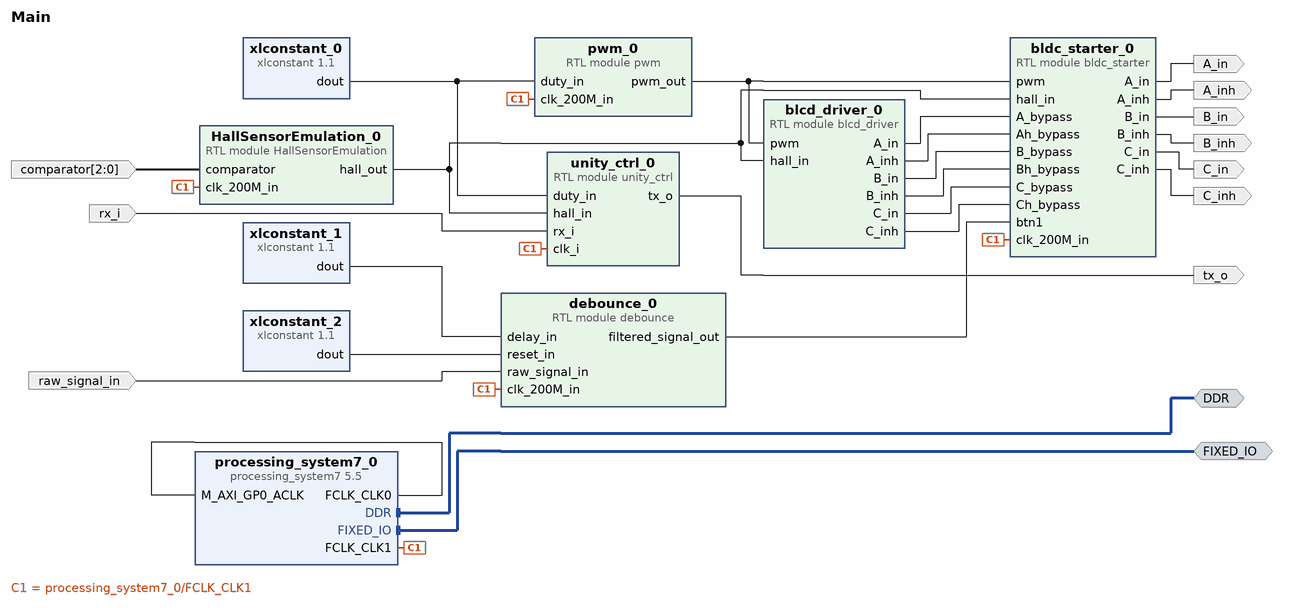
[diagram p0: block diagram of the top level]
# Vivado block design Main, xc7z010clg225-1, Vivado 2017.2
create_bd_design Main

create_bd_intf_port -mode Master -vlnv xilinx.com:interface:ddrx_rtl:1.0 DDR
create_bd_intf_port -mode Master -vlnv xilinx.com:display_processing_system7:fixedio_rtl:1.0 FIXED_IO
create_bd_port -dir I -from 2 -to 0 comparator
create_bd_port -dir O tx_o
create_bd_port -dir I rx_i
create_bd_port -dir O A_in
create_bd_port -dir O A_inh
create_bd_port -dir O B_in
create_bd_port -dir O B_inh
create_bd_port -dir O C_in
create_bd_port -dir O C_inh
create_bd_port -dir I raw_signal_in

create_bd_cell -type ip -vlnv xilinx.com:ip:xlconstant:1.1 xlconstant_0
set_property -dict {CONFIG.CONST_WIDTH 8 CONFIG.CONST_VAL 160} [get_bd_cells xlconstant_0]
create_bd_cell -type ip -vlnv xilinx.com:ip:processing_system7:5.5 processing_system7_0
set_property -dict [list \
  CONFIG.PCW_FCLK_CLK1_BUF TRUE \
  CONFIG.PCW_UIPARAM_DDR_FREQ_MHZ 533.333333 \
  CONFIG.PCW_APU_PERIPHERAL_FREQMHZ 666.666666 \
  CONFIG.PCW_SDIO_PERIPHERAL_FREQMHZ 100 \
  CONFIG.PCW_UART_PERIPHERAL_FREQMHZ 100 \
  CONFIG.PCW_I2C_PERIPHERAL_FREQMHZ 111.111115 \
  CONFIG.PCW_FPGA0_PERIPHERAL_FREQMHZ 50 \
  CONFIG.PCW_FPGA1_PERIPHERAL_FREQMHZ 200 \
  CONFIG.PCW_M_AXI_GP0_FREQMHZ 50 \
  CONFIG.PCW_USE_FABRIC_INTERRUPT 1 \
  CONFIG.PCW_NUM_F2P_INTR_INPUTS 1 \
  CONFIG.PCW_DQ_WIDTH 16 \
  CONFIG.PCW_DQS_WIDTH 2 \
  CONFIG.PCW_DM_WIDTH 2 \
  CONFIG.PCW_MIO_PRIMITIVE 32 \
  CONFIG.PCW_EN_CLK1_PORT 1 \
  CONFIG.PCW_IRQ_F2P_INTR 1 \
  CONFIG.PCW_PERIPHERAL_BOARD_PRESET part0 \
  CONFIG.PCW_PRESET_BANK1_VOLTAGE {LVCMOS 3.3V} \
  CONFIG.PCW_UIPARAM_DDR_MEMORY_TYPE {DDR 3 (Low Voltage)} \
  CONFIG.PCW_UIPARAM_DDR_BUS_WIDTH {16 Bit} \
  CONFIG.PCW_UIPARAM_DDR_PARTNO {MT41J256M16 RE-125} \
  CONFIG.PCW_QSPI_PERIPHERAL_ENABLE 1 \
  CONFIG.PCW_QSPI_QSPI_IO {MIO 1 .. 6} \
  CONFIG.PCW_QSPI_GRP_SINGLE_SS_ENABLE 1 \
  CONFIG.PCW_QSPI_GRP_SINGLE_SS_IO {MIO 1 .. 6} \
  CONFIG.PCW_ENET0_PERIPHERAL_ENABLE 0 \
  CONFIG.PCW_SD0_PERIPHERAL_ENABLE 0 \
  CONFIG.PCW_SD1_PERIPHERAL_ENABLE 1 \
  CONFIG.PCW_SD1_SD1_IO {MIO 10 .. 15} \
  CONFIG.PCW_SD1_GRP_CD_ENABLE 1 \
  CONFIG.PCW_SD1_GRP_CD_IO {MIO 0} \
  CONFIG.PCW_UART1_PERIPHERAL_ENABLE 1 \
  CONFIG.PCW_UART1_UART1_IO {MIO 8 .. 9} \
  CONFIG.PCW_TTC0_PERIPHERAL_ENABLE 1 \
  CONFIG.PCW_TTC0_TTC0_IO EMIO \
  CONFIG.PCW_USB0_PERIPHERAL_ENABLE 1 \
  CONFIG.PCW_USB0_USB0_IO {MIO 28 .. 39} \
  CONFIG.PCW_USB_RESET_ENABLE 1 \
  CONFIG.PCW_USB_RESET_SELECT {Share reset pin} \
  CONFIG.PCW_USB0_RESET_ENABLE 1 \
  CONFIG.PCW_USB0_RESET_IO {MIO 7} \
  CONFIG.PCW_I2C1_PERIPHERAL_ENABLE 1 \
  CONFIG.PCW_I2C1_I2C1_IO {MIO 48 .. 49} \
  CONFIG.PCW_I2C1_GRP_INT_ENABLE 1 \
  CONFIG.PCW_I2C1_GRP_INT_IO EMIO \
  CONFIG.PCW_I2C_RESET_ENABLE 1 \
  CONFIG.PCW_I2C_RESET_SELECT {Share reset pin} \
  CONFIG.PCW_GPIO_MIO_GPIO_ENABLE 1 \
  CONFIG.PCW_GPIO_MIO_GPIO_IO MIO \
  CONFIG.PCW_APU_CLK_RATIO_ENABLE 0.251400462962963 \
  CONFIG.PCW_ENET0_PERIPHERAL_CLKSRC External \
  CONFIG.PCW_UIPARAM_GENERATE_SUMMARY NONE \
  CONFIG.PCW_FPGA_FCLK1_ENABLE 1 \
] [get_bd_cells processing_system7_0]
# 427 more settings of processing_system7_0 are not shown: defaults, MIO pin electricals, DDR timing, and values the tool derives
create_bd_cell -type module -reference HallSensorEmulation HallSensorEmulation_0
create_bd_cell -type module -reference unity_ctrl unity_ctrl_0
create_bd_cell -type module -reference debounce debounce_0
create_bd_cell -type ip -vlnv xilinx.com:ip:xlconstant:1.1 xlconstant_1
set_property -dict {CONFIG.CONST_WIDTH 24 CONFIG.CONST_VAL 7000000} [get_bd_cells xlconstant_1]
create_bd_cell -type ip -vlnv xilinx.com:ip:xlconstant:1.1 xlconstant_2
set_property -dict {CONFIG.CONST_VAL 0} [get_bd_cells xlconstant_2]
create_bd_cell -type module -reference pwm pwm_0
create_bd_cell -type module -reference blcd_driver blcd_driver_0
create_bd_cell -type module -reference bldc_starter bldc_starter_0

# ---- connections ----

connect_bd_intf_net [get_bd_intf_ports DDR] [get_bd_intf_pins processing_system7_0/DDR]
connect_bd_intf_net [get_bd_intf_ports FIXED_IO] [get_bd_intf_pins processing_system7_0/FIXED_IO]
connect_bd_net [get_bd_pins processing_system7_0/FCLK_CLK0] [get_bd_pins processing_system7_0/M_AXI_GP0_ACLK]
connect_bd_net [get_bd_ports comparator] [get_bd_pins HallSensorEmulation_0/comparator]
connect_bd_net [get_bd_pins HallSensorEmulation_0/hall_out] \
  [get_bd_pins unity_ctrl_0/hall_in] [get_bd_pins blcd_driver_0/hall_in] [get_bd_pins bldc_starter_0/hall_in]
connect_bd_net [get_bd_pins processing_system7_0/FCLK_CLK1] \
  [get_bd_pins HallSensorEmulation_0/clk_200M_in] [get_bd_pins unity_ctrl_0/clk_i] [get_bd_pins debounce_0/clk_200M_in] \
  [get_bd_pins pwm_0/clk_200M_in] [get_bd_pins bldc_starter_0/clk_200M_in]
connect_bd_net [get_bd_pins unity_ctrl_0/tx_o] [get_bd_ports tx_o]
connect_bd_net [get_bd_ports rx_i] [get_bd_pins unity_ctrl_0/rx_i]
connect_bd_net [get_bd_pins pwm_0/pwm_out] [get_bd_pins blcd_driver_0/pwm] [get_bd_pins bldc_starter_0/pwm]
connect_bd_net [get_bd_pins xlconstant_0/dout] [get_bd_pins unity_ctrl_0/duty_in] [get_bd_pins pwm_0/duty_in]
connect_bd_net [get_bd_pins bldc_starter_0/A_in] [get_bd_ports A_in]
connect_bd_net [get_bd_pins bldc_starter_0/A_inh] [get_bd_ports A_inh]
connect_bd_net [get_bd_pins bldc_starter_0/B_in] [get_bd_ports B_in]
connect_bd_net [get_bd_pins bldc_starter_0/B_inh] [get_bd_ports B_inh]
connect_bd_net [get_bd_pins bldc_starter_0/C_in] [get_bd_ports C_in]
connect_bd_net [get_bd_pins bldc_starter_0/C_inh] [get_bd_ports C_inh]
connect_bd_net [get_bd_pins blcd_driver_0/A_in] [get_bd_pins bldc_starter_0/A_bypass]
connect_bd_net [get_bd_pins blcd_driver_0/A_inh] [get_bd_pins bldc_starter_0/Ah_bypass]
connect_bd_net [get_bd_pins blcd_driver_0/B_in] [get_bd_pins bldc_starter_0/B_bypass]
connect_bd_net [get_bd_pins blcd_driver_0/B_inh] [get_bd_pins bldc_starter_0/Bh_bypass]
connect_bd_net [get_bd_pins blcd_driver_0/C_in] [get_bd_pins bldc_starter_0/C_bypass]
connect_bd_net [get_bd_pins blcd_driver_0/C_inh] [get_bd_pins bldc_starter_0/Ch_bypass]
connect_bd_net [get_bd_pins debounce_0/filtered_signal_out] [get_bd_pins bldc_starter_0/btn1]
connect_bd_net [get_bd_ports raw_signal_in] [get_bd_pins debounce_0/raw_signal_in]
connect_bd_net [get_bd_pins xlconstant_1/dout] [get_bd_pins debounce_0/delay_in]
connect_bd_net [get_bd_pins xlconstant_2/dout] [get_bd_pins debounce_0/reset_in]

validate_bd_design
save_bd_design
